# Altium schematic sheet 02.SchDoc
size A3; CompanyName: 瀬沼電子; Organization: 瀬沼電子; Address1: 〒197-0827; Address2: 東京都あきる野; Address3: 油平259; Phone: 042-558-0141; Rule: PcbType=ProtelPcb
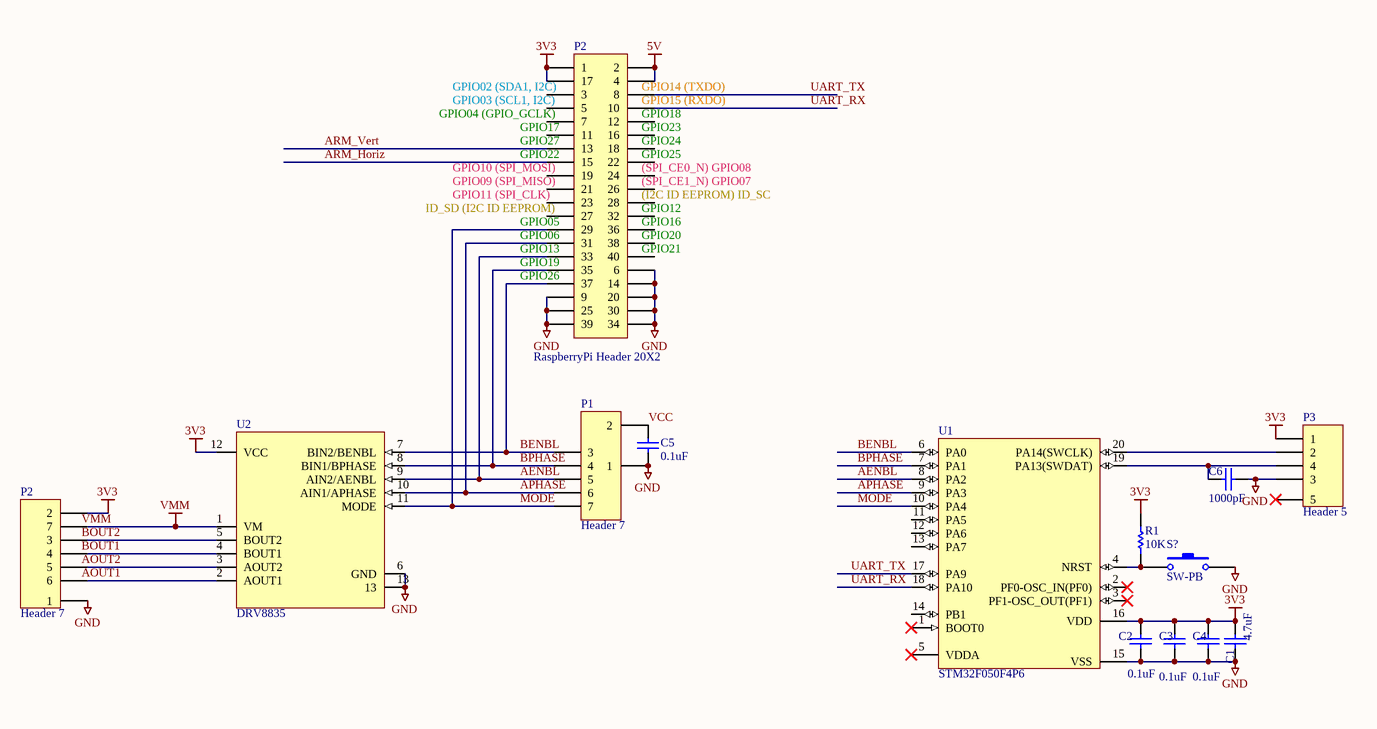
[diagram p0: 02.SchDoc]

## Parts
(Parts that share a designator on the sheet are numbered #1, #2 ... from top to bottom, then left to right.)
C1  4.7uF  [1608[0603]]
C2  0.1uF  [1608[0603]]
C3  0.1uF  [1608[0603]]
C4  0.1uF  [1608[0603]]
C5  0.1uF  [1608[0603]]
C6  1000pF  [1608[0603]]
P1  Header 7  [HDR1X7]
P2#1  RaspberryPi Header 20X2  [HDR2X20]
P2#2  Header 7  [HDR1X7]
P3  Header 5  [HDR1X5]
R1  10K  [RESC0603(1608)_N]
S?  SW-PB  [SPST-2]
U1  STM32F050F4P6  [STM-TSSOP20_M]
U2  DRV8835

## Nets
3V3: C1.1 C2.1 C3.1 C4.1 P2#1.1 P2#1.17 P2#2.2 P3.1 R1.1 U1.16(VDD) U2.12(VCC)
5V: P2#1.2 P2#1.4
GND: C1.2 C2.2 C3.2 C4.2 C5.2 C6.2 P1.1 P2#1.6 P2#1.9 P2#1.14 P2#1.20 P2#1.25 P2#1.30 P2#1.34 P2#1.39 P2#2.1 P3.3 S?.2 U1.15(VSS) U2.6(GND) U2.13
VMM: P2#2.7 U2.1(VM)
AENBL: P1.5 P2#1.33 U1.8(PA2) U2.9(AIN2/AENBL)
APHASE: P1.6 P2#1.31 U1.9(PA3) U2.10(AIN1/APHASE)
ARM_Horiz: P2#1.15
ARM_Vert: P2#1.13
BENBL: P1.3 P2#1.37 U1.6(PA0) U2.7(BIN2/BENBL)
BPHASE: P1.4 P2#1.35 U1.7(PA1) U2.8(BIN1/BPHASE)
MODE: P1.7 P2#1.29 U1.10(PA4) U2.11(MODE)
UART_RX: P2#1.10 U1.18(PA10)
UART_TX: P2#1.8 U1.17(PA9)
VCC: C5.1 P1.2
NetC6_1: C6.1 P3.4 U1.19(PA13(SWDAT))
NetP2#2_3: P2#2.3 U2.5(BOUT2)
NetP2#2_4: P2#2.4 U2.4(BOUT1)
NetP2#2_5: P2#2.5 U2.3(AOUT2)
NetP2#2_6: P2#2.6 U2.2(AOUT1)
NetP3_2: P3.2 U1.20(PA14(SWCLK))
NetR1_2: R1.2 S?.1 U1.4(NRST)

Not connected (* = marked no-connect by the designer): P2#1 3 5 7 11 12 16 18 19 21 22 23 24 26 27 28 32 36 38 40; P3 5*; U1 1(BOOT0)* 2(PF0-OSC_IN(PF0))* 3(PF1-OSC_OUT(PF1))* 5(VDDA)* 11(PA5) 12(PA6) 13(PA7) 14(PB1)

## Notes on the sheet
- (near P2#1) GPIO04 (GPIO_GCLK)
- (near P2#1) GPIO02 (SDA1, I2C)
- (near P2#1) GPIO03 (SCL1, I2C)
- (near P2#1) GPIO14 (TXDO)
- (near P2#1) GPIO15 (RXDO)
- (near P2#1) GPIO18
- (near P2#1) GPIO09 (SPI_MISO)
- (near P2#1) GPIO10 (SPI_MOSI)
- (near P2#1) GPIO17
- (near P2#1) GPIO22
- (near P2#1) GPIO27
- (near P2#1) (SPI_CE1_N) GPIO07
- (near P2#1) (SPI_CE0_N) GPIO08
- (near P2#1) GPIO23
- (near P2#1) GPIO24
- (near P2#1) GPIO25
- (near P2#1) ID_SD (I2C ID EEPROM)
- (near P2#1) GPIO11 (SPI_CLK)
- (near P2#1) GPIO05
- (near P2#1) GPIO06
- (near P2#1) GPIO13
- (near P2#1) GPIO12
- (near P2#1) GPIO16
- (near P2#1) GPIO20
- (near P2#1) GPIO21
- (near P2#1) (I2C ID EEPROM) ID_SC
- (near P2#1) GPIO19
- (near P2#1) GPIO26
- Labels drawn without touching a wire or pin: AOUT1, AOUT2, BOUT1, BOUT2, VMM
- A3
- Designer:
- Company:
- Title:
- Dept.:
- Email:
- Revisions:
- Notes:
- File:
- Scale:
- rev:
- sheet:
- of
- Marked:

## Library data of the parts
C1-C6 = Cap: Capacitor; Published: 8-Jun-2000; LatestRevisionDate: 17-Jul-2002; LatestRevisionNote: Re-released for DXP Platform.; PackageReference: RAD-0.3; Publisher: Altium Limited; PackageDescription: Radial Cap, Thru-Hole; 2 Leads; 0.3 in Pin Spacing
  C1: Value: 4.7uF
  C2-C5: Value: 0.1uF
  C6: Value: 1000pF
P1 P2#2 = Header 7: Header, 7-Pin; LatestRevisionDate: 17-Jul-2002; LatestRevisionNote: Re-released for DXP Platform.; Publisher: Altium Limited
P2#1 = Header 20X2: Header, 20-Pin, Dual row; LatestRevisionDate: 17-Jul-2002; LatestRevisionNote: Re-released for DXP Platform.; Publisher: Altium Limited
P3 = Header 5: Header, 5-Pin; LatestRevisionDate: 17-Jul-2002; LatestRevisionNote: Re-released for DXP Platform.; Publisher: Altium Limited
R1 = CMP-1012-00514-1: 10K 0.1W 1% 0603 (1608 Metric)  SMD; Case-Metric: 1608; Case-EIA: 0603; Technology: SMT; Tolerance: 1 %; Value: 10K; Power: 0.1 W
S? = SW-PB: Switch; Published: 24-Mar-1999; LatestRevisionDate: 17-Jul-2002; LatestRevisionNote: Re-released for DXP Platform.; PackageReference: SPST-2; Publisher: Altium Limited; PackageDescription: Switch; 2 Leads
U1 = CMP-0304-00038-2: ARM Cortex-M0 32-bit MCU, 16 KB Flash, 4 KB Internal RAM, 15 I/Os, 20-pin TSSOP, -40 to 85 degC, Tube; Supply Voltage(Vcc) min (V): 2; Internal RAM Size (kB): 4; I/Os (High Current): 15; Operating Frequency(F) (Processor speed) (MHz): 48; FLASH Size (Prog) (kB): 16; ComponentLink2Description: Datasheet; PackageDescription: 20-Pin Thin Shrink Small Outline Package, 6.5 x 4.4 mm Body, 0.65 mm Pitch; ComponentLink1Description: Manufacturer URL; Packing: Tube; DatasheetVersion: Rev. 1; Mounting Technology: Surface Mount; ComponentLink3Description: Package Specification; PartNumber: STM32F050F4P6; PackageVersion: Rev. 1, 11/2012; Core: ARM Cortex-M0; ComponentLink3URL: http://www.st.com/st-web-ui/static/active/en/resource/technical/document/datasheet/DM00065136.pdf; PackageReference: TSSOP20; ComponentLink2URL: http://www.st.com/st-web-ui/static/active/en/resource/technical/document/datasheet/DM00065136.pdf; ComponentLink1URL: http://www.st.com/web/en/home.html